# Altium schematic sheet 单片机供电.SchDoc
size A4
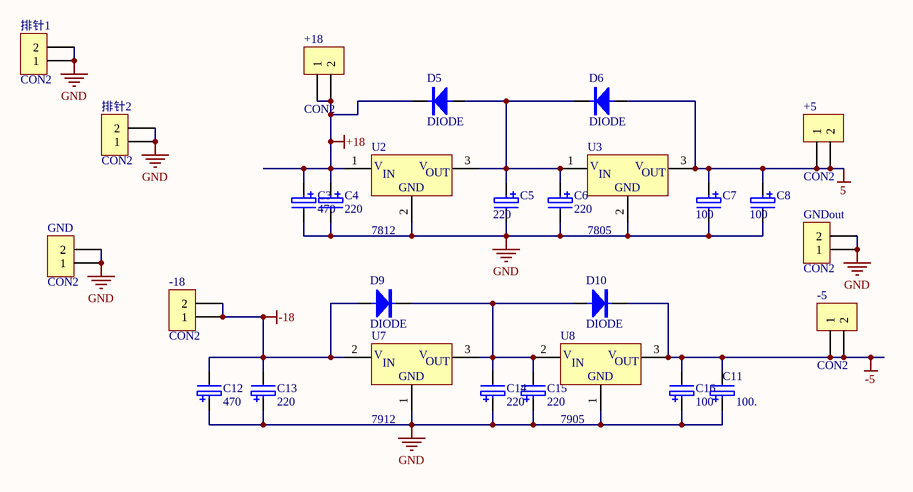
[diagram p0: 单片机供电.SchDoc]

## Parts
+5  CON2  [2P-200]
+18  CON2  [2P-200]
-5  CON2  [2P-200]
-18  CON2  [2P-200]
C3  470  [CAO4]
C4  220  [CAO4]
C5  220  [CAO4]
C6  220  [CAO4]
C7  100  [CAO4]
C8  100  [CAO4]
C11  100.  [CAO4]
C12  470  [CAO4]
C13  220  [CAO4]
C14  220  [CAO4]
C15  220  [CAO4]
C16  100  [CAO4]
D5  DIODE  [DIODE0.4]
D6  DIODE  [DIODE0.4]
D9  DIODE  [DIODE0.4]
D10  DIODE  [DIODE0.4]
GND  CON2  [2P-200]
GNDout  CON2  [2P-200]
U2  7812  [TO-220]
U3  7805  [TO-220]
U7  7912  [TO-220]
U8  7905  [TO-220]
排针1  CON2  [sip-2]
排针2  CON2  [sip-2]

## Nets
5: +5.1 +5.2 C7.1 C8.1 D6.1 U3.3(VOUT)
+18: +18.1 +18.2 C3.1 C4.1 D5.2 U2.1(VIN)
-5: -5.1 -5.2 C11.2 C16.2 D10.2 U8.3(VOUT)
-18: -18.1 -18.2 C12.2 C13.2 D9.1 U7.2(VIN)
GND: C3.2 C4.2 C5.2 C6.2 C7.2 C8.2 C11.1 C12.1 C13.1 C14.1 C15.1 C16.1 GND.1 GND.2 GNDout.1 GNDout.2 U2.2(GND) U3.2(GND) U7.1(GND) U8.1(GND) 排针1.1 排针1.2 排针2.1 排针2.2
NetC5_1: C5.1 C6.1 D5.1 D6.2 U2.3(VOUT) U3.1(VIN)
NetC14_2: C14.2 C15.2 D9.2 D10.1 U7.3(VOUT) U8.2(VIN)

## Notes on the sheet
- (in symbol 78LXX) V; IN; OUT
- (in symbol 79LXX) V; IN; OUT

## Library data of the parts
+5 +18 -5 -18 GND GNDout 排针1 排针2 = CON2: Connector
C3-C8 C11-C16 = CAP3
U2 U3 = 78LXX: 3-Terminal Positive Voltage Regulator
U7 U8 = 79LXX